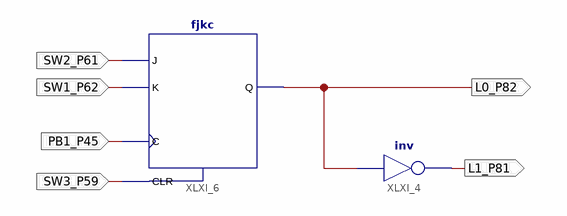
[diagram p0: schematic sheet 1]
// Xilinx ISE schematic Lab_05A_1.sch (spartan6) as structural Verilog: 2 symbols, 6 ports
module Lab_05A_1 (
  input  SW1_P62,
  input  PB1_P45,
  input  SW3_P59,
  input  SW2_P61,
  output L0_P82,
  output L1_P81
);

  not XLXI_4 (L1_P81, L0_P82);
  fjkc XLXI_6 (.C(PB1_P45), .CLR(SW3_P59), .J(SW2_P61), .K(SW1_P62), .Q(L0_P82));
endmodule
